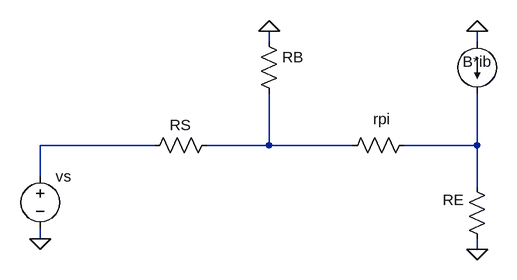
[diagram p0: schematic prob6_50D_AC_small-signal_equivalent.asc]
prob6_50D_AC_small-signal_equivalent.asc, the LTspice schematic file:
Version 4
SHEET 1 880 680
WIRE 320 -64 320 -80
WIRE 640 -64 640 -80
WIRE 144 96 -32 96
WIRE 320 96 320 16
WIRE 320 96 224 96
WIRE 448 96 320 96
WIRE 640 96 640 16
WIRE 640 96 528 96
WIRE -32 144 -32 96
WIRE 640 160 640 96
WIRE -32 240 -32 224
WIRE 640 256 640 240
FLAG -32 240 0
FLAG 640 256 0
FLAG 320 -80 0
FLAG 640 -80 0
SYMBOL voltage -32 128 R0
SYMATTR InstName vs
SYMATTR Value ""
SYMBOL res 304 -80 R0
SYMATTR InstName RB
SYMATTR Value ""
SYMBOL res 240 80 R90
WINDOW 0 0 56 VBottom 2
WINDOW 3 32 56 VTop 2
SYMATTR InstName RS
SYMATTR Value ""
SYMBOL res 544 80 R90
WINDOW 0 -9 50 VBottom 2
WINDOW 3 32 56 VTop 2
SYMATTR InstName rpi
SYMATTR Value ""
SYMBOL res 656 256 R180
WINDOW 0 36 76 Left 2
WINDOW 3 36 40 Left 2
SYMATTR InstName RE
SYMATTR Value ""
SYMBOL current 640 -64 R0
WINDOW 0 -22 31 Left 2
SYMATTR InstName B*ib
SYMATTR Value ""

The netlist it stands for:
* prob6_50D_AC_small-signal_equivalent.asc
vs N001 0
RB 0 N002
RS N002 N001
rpi N003 N002
RE 0 N003
I§B*ib 0 N003
.backanno
.end